# EAGLE schematic Slot Test (EAGLE 9.6.2)
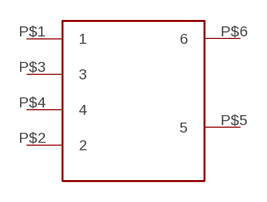
[diagram p0: schematic, sheet 1]

## Parts
U$1  L503-13B05R$3  [LS03-13BO5R3]
Unconnected: U$1.P$1 U$1.P$2 U$1.P$3 U$1.P$4 U$1.P$5 U$1.P$6

## Library data of the parts
U$1 = MORNSUN 5V Isolated:L503-13B05R$3